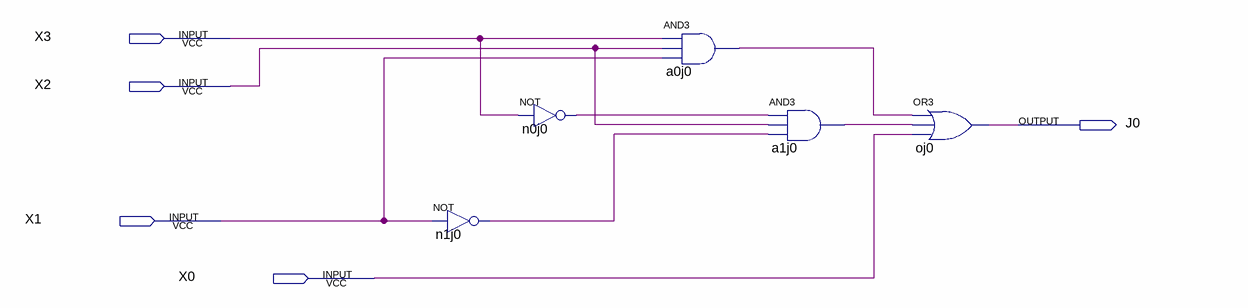
[diagram p0: schematic sheet]
// Quartus schematic J0.bdf as structural Verilog: 5 symbols, 5 pins
module J0 (
  input  X3,
  input  X2,
  input  X1,
  input  X0,
  output J0
);

  wire a0j0_out, a1j0_out, n0j0_out, n1j0_out;

  not n1j0 (n1j0_out, X1);
  not n0j0 (n0j0_out, X3);
  and a0j0 (a0j0_out, X3, X2, X1);
  and a1j0 (a1j0_out, n0j0_out, X2, n1j0_out);
  or oj0 (J0, a0j0_out, a1j0_out, X0);
endmodule
